# EasyEDA schematic SCH_Record-wav_2025-12-09 (1).json
TITLE: 1.2; REV: 1.0; Date: 2025-11-29; Sheet: 1/1; Drawn By: Shaik Sohail Ahmed; Company: novum
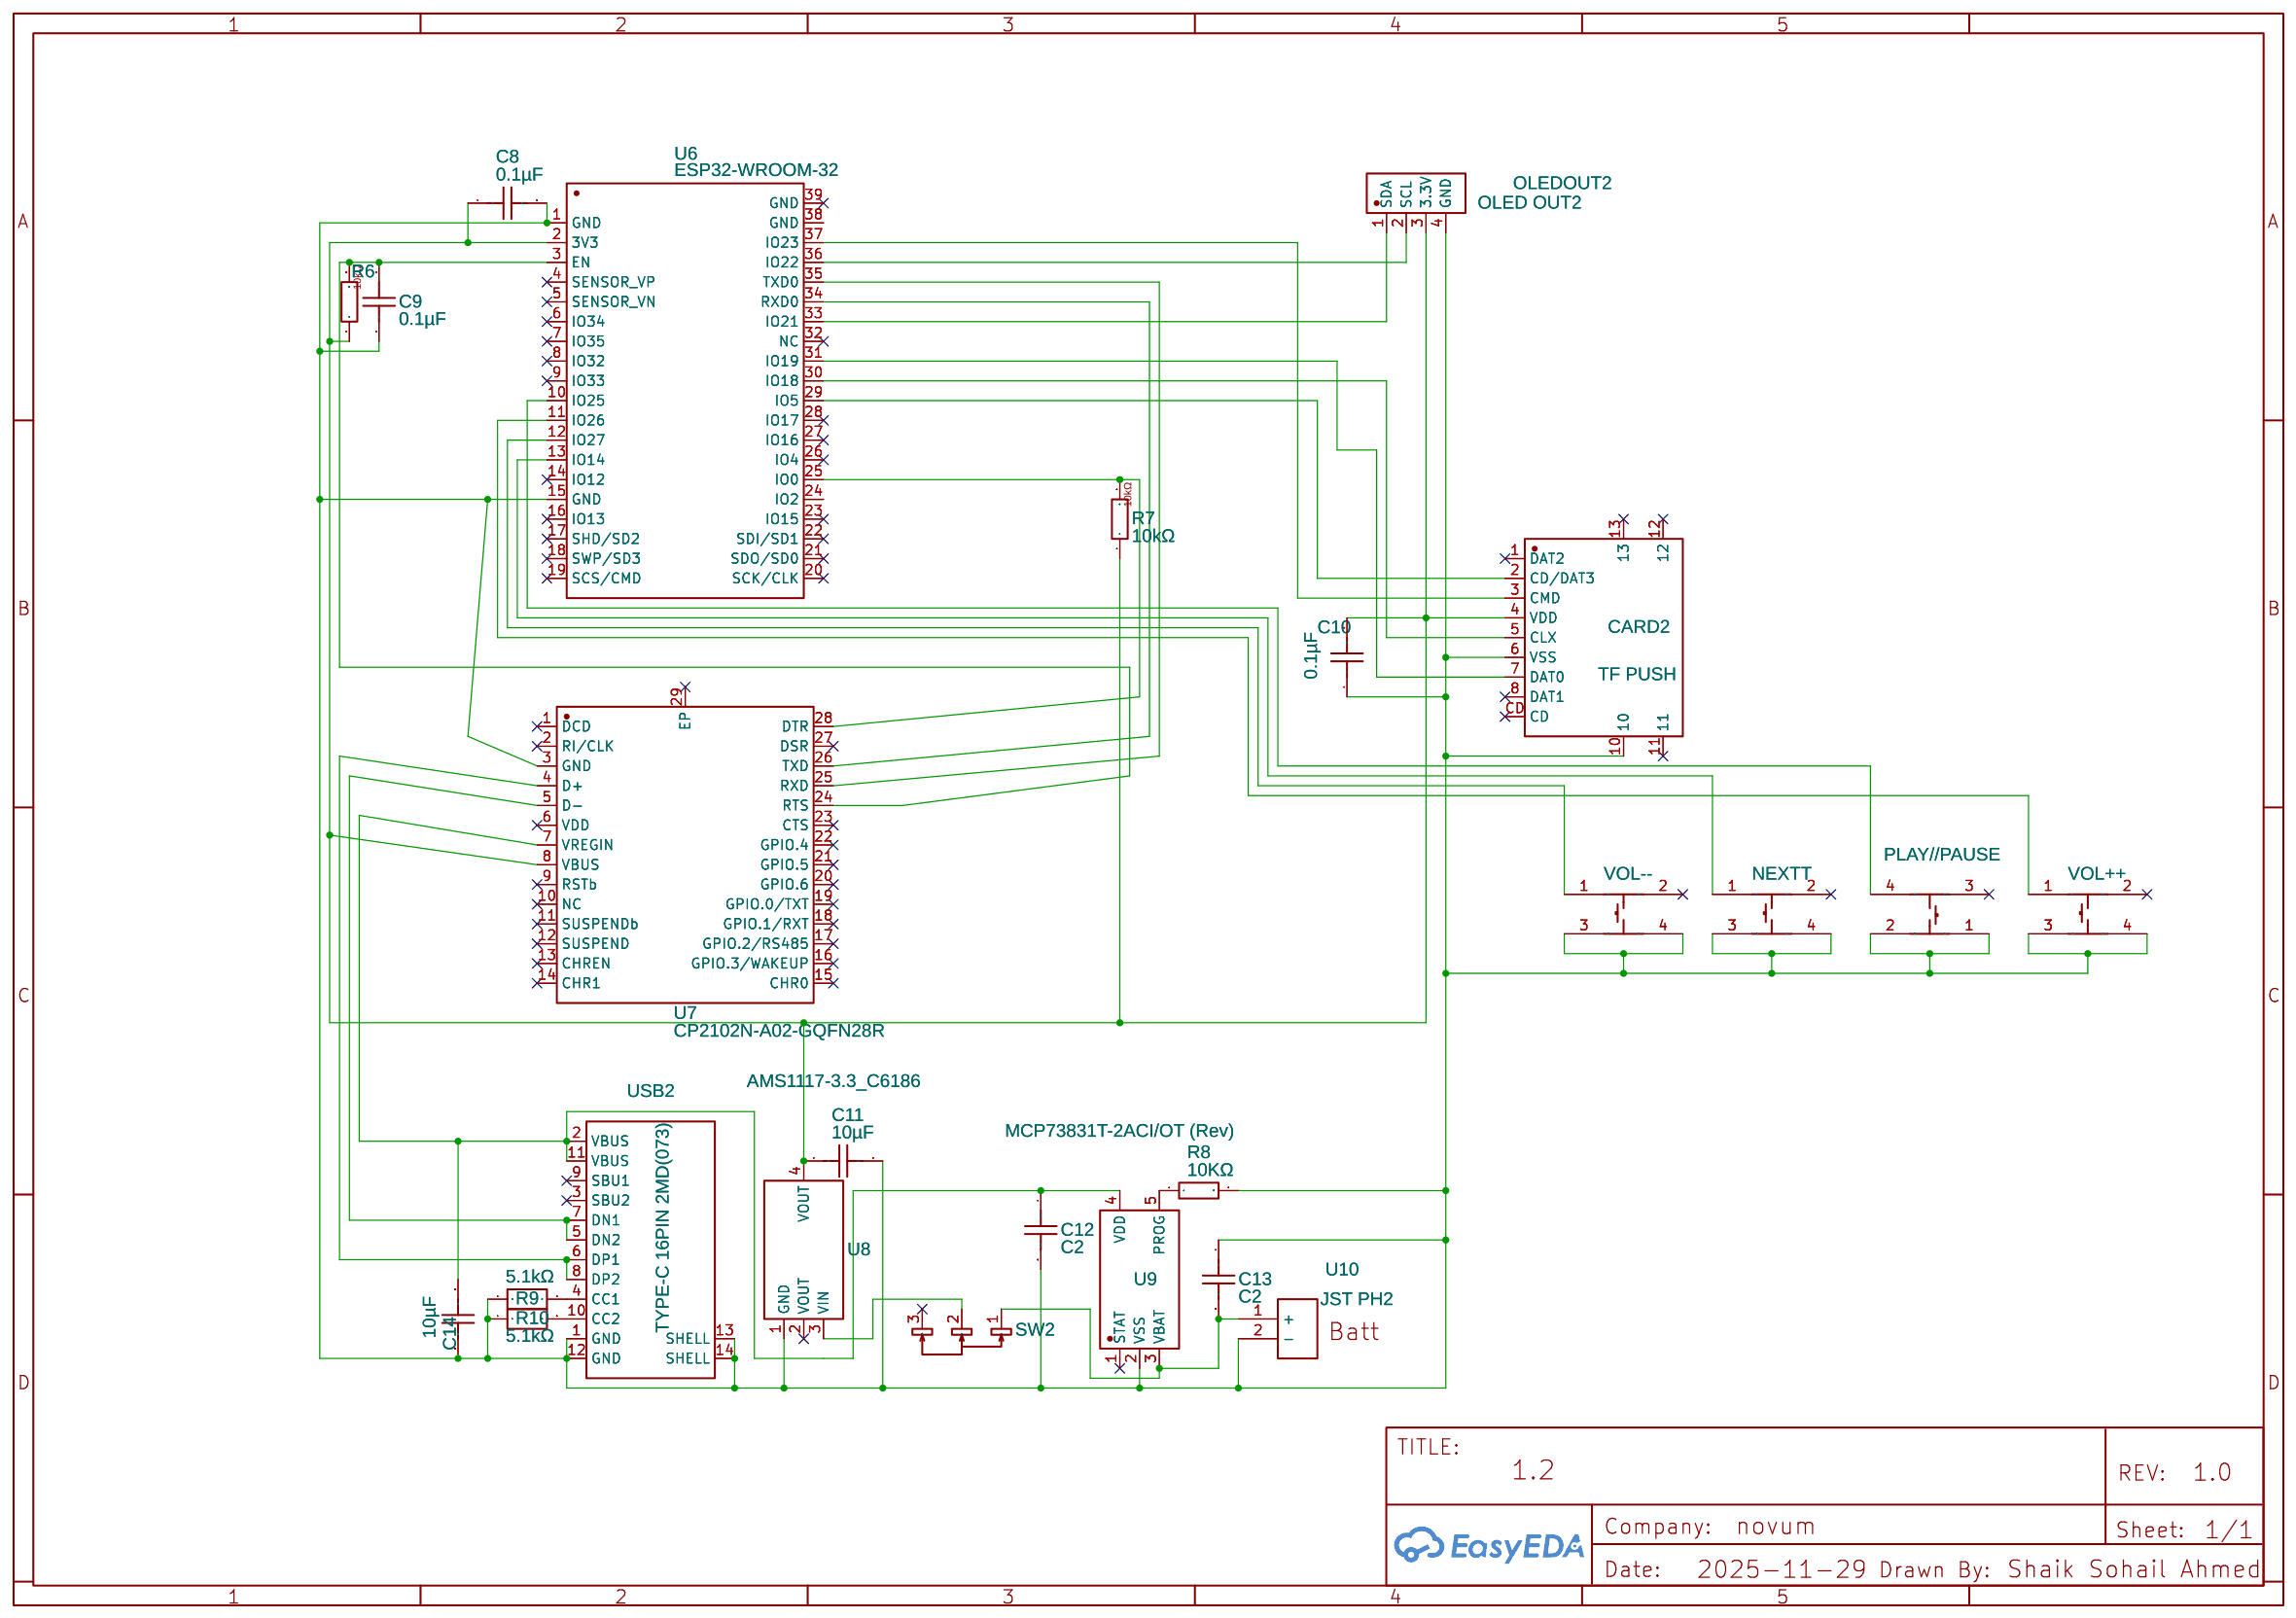
[diagram p0: schematic sheet]

## Parts
C8  0.1µF  [0402]
C9  0.1µF  [0402]
C10  0.1µF  [0402]
C11  10µF  [C0603]
C12  C2  [D0805]
C13  C2  [D0805]
C14  10µF  [C0603]
CARD2  TF PUSH  [TF-SMD_TF-PUSH]
NEXTT  TS-1002S-07026C  [KEY-SMD_4P-L6.0-W6.0-P4.50-LS9.0]
OLEDOUT2  OLED OUT2  [PADPAD4X1.5 4PAD_SIGNALS]
PLAY//PAUSE  TS-1002S-07026C  [KEY-SMD_4P-L6.0-W6.0-P4.50-LS9.0]
R6  10kΩ  [10KΩ]
R7  10kΩ  [10KΩ]
R8  10KΩ  [AXIAL-0.4]
R9  5.1kΩ  [R1206]
R10  5.1kΩ  [R1206]
SW2  MST-12D18G4 SPDT SLIDE SWITCH  [SW-SMD_MST-12D18G4-SPDT-SLIDE-SWITCH]
U6  ESP32-WROOM-32  [WIFIM-SMD_ESP32-WROOM-32-N4]
U7  CP2102N-A02-GQFN28R  [QFN-28_L5.0-W5.0-P0.50-TL-EP3.3]
U8  AMS1117-3.3_C6186  [AMS1117]
U9  MCP73831T-2ACI/OT (Rev)  [SOT-23-5_L3.0-W1.7-P0.95-LS2.8-BL]
U10  JST PH2  [JST-PH-JST-PH2]
USB2  TYPE-C 16PIN 2MD(073)  [USB-C-SMD_TYPE-C-6PIN-2MD-073]
VOL++  TS-1002S-07026C  [KEY-SMD_4P-L6.0-W6.0-P4.50-LS9.0]
VOL--  TS-1002S-07026C  [KEY-SMD_4P-L6.0-W6.0-P4.50-LS9.0]

## Library data of the parts
C8-C10 = 0.1µF: Supplier Part: C86039; Supplier: LCSC; Manufacturer: muRata; Manufacturer Part: GRM152R60J104ME19D
C11 C14 = CL10A106MA8NRNC: Manufacturer: Samsung Electro-Mechanics; Supplier Part: 1276-1869-1-ND; Supplier: Digi-Key; link: https://www.digikey.ca/en/products/detail/samsung-electro-mechanics/CL10A106MA8NRNC/3887527; Contributor: deserresalex; Voltage: 25V; Tolerance: 20%
C12 C13 = 08053C105JAT2A: Manufacturer: KYOCERA AVX; Supplier: Digi-Key; Supplier Part: 478-10487-1-ND; link: https://www.digikey.ca/en/products/detail/kyocera-avx/08053C105JAT2A/1602174; Contributor: efpepeople
CARD2 = TF PUSH: Contributor: LCSC; Supplier: LCSC; Supplier Part: C393941; Manufacturer: SHOU HAN(首韩); JLCPCB Part Class: Extended Part
NEXTT PLAY//PAUSE VOL++ VOL-- = TS-1002S-07026C: Contributor: LCSC; Supplier: LCSC; Supplier Part: C455114; Manufacturer: XUNPU(讯普); JLCPCB Part Class: Extended Part
OLEDOUT2 = Solder_Pad_4: Contributor: dwaterkott
R6 R7 = 10kΩ: Contributor: Aries Castillo
R8 = 10KΩ: Power: 1/4W; Tolerance: ±5%; Supplier Part: C61299; Supplier: LCSC; Manufacturer Part: CFR0W4J0103A50; Manufacturer: UniOhm
R9 R10 = 5.1KΩ 1/4W ±1% SMD: Supplier: LCSC; Supplier Part: C2933721; Manufacturer: FOJAN(富捷); Manufacturer Part: FRC1206F5101TS; JLCPCB Part Class: Extended Part; Contributor: lcsc
SW2 = MST-12D18G4 SPDT SLIDE SWITCH: Supplier: LCSC; Supplier Part: C49023767; Manufacturer: SHOU HAN(首韩); Manufacturer Part: MST-12D18G4 SPDT Slide Switch; JLCPCB Part Class: Extended Part; Contributor: lcsc
U6 = ESP32-WROOM-32: Contributor: LCSC; Supplier: LCSC; Supplier Part: C82899; Manufacturer: ESPRESSIF(乐鑫); Manufacturer Part: ESP32-WROOM-32-N4; JLCPCB Part Class: Extended Part
U7 = CP2102N-A02-GQFN28R: Contributor: LCSC; Supplier: LCSC; Supplier Part: C964632; Manufacturer: SKYWORKS/SILICON LABS(芯科); JLCPCB Part Class: Extended Part
U8 = AMS1117-3.3_C6186: Output Type: Output Polarity:Positive Number of Outputs:1 Maximum Input Voltage:- Output Voltage:3.3V~3.3V Output Voltage:3.3V~3.3V Dropout Voltage:1.3V@(800mA) Quiescent Current (Ground Current):- Output Current:1A Power Supply Rejection Ratio (PSRR):72d; Name: AMS1117-3.3; Symbol: AMS1117-3.3; LCSC Part Name: 输出3.3V 1A; Supplier Part: C6186; Manufacturer: AMS; Manufacturer Part: AMS1117-3.3; Supplier Footprint: SOT-223; JLCPCB Part Class: Basic Part; Datasheet: https://atta.szlcsc.com/upload/public/pdf/source/20180727/C6186_7A095716F0823C02F1997A905E26C086.pdf; Supplier: LCSC; Add into BOM: yes; Convert to PCB: yes; Output Polarity: Positive; Number of Outputs: 1; Output Voltage: 3.3V~3.3V; Dropout Voltage: 1.3V@(800mA); Output Current: 1A; Power Supply Rejection Ratio (PSRR): 72dB@(120Hz); Contributor: simplenikt
U9 = MCP73831T-2ACI/OT (Rev): Contributor: mikeraffone; Supplier: LCSC; Supplier Part: C424093; Manufacturer: MICROCHIP(美国微芯); Manufacturer Part: MCP73831T-2ACI/OT; JLCPCB Part Class: Extended Part
U10 = JST PH2: Contributor: pwarrow99
USB2 = TYPE-C 16PIN 2MD(073): Supplier: LCSC; Supplier Part: C2765186; Manufacturer: SHOU HAN(首韩); Contributor: jplobst; JLCPCB Part Class: Extended Part

## Nets
Net-(C8-1): C8.1 C10.2 C11.1 CARD2.4(VDD) OLEDOUT2.3(3.3V) R6.1 R7.1 U6.2(3V3) U7.8(VBUS) U8.4(VOUT)
Net-(C8-2): C8.2 C9.1 C10.1 C11.2 C12.2 C13.1 C14.2 CARD2.6(VSS) CARD2.10 NEXTT.3 NEXTT.4 OLEDOUT2.4(GND) PLAY//PAUSE.1 PLAY//PAUSE.2 R8.2 R9.1 R10.1 U6.1(GND) U6.15(GND) U7.3(GND) U8.1(GND) U9.2(VSS) U10.2(-) USB2.1(GND) USB2.12(GND) USB2.13(SHELL) USB2.14(SHELL) VOL++.3 VOL++.4 VOL--.3 VOL--.4
Net-(C9-2): C9.2 R6.2 U6.3(EN) U7.24(RTS)
Net-(C12-1): C12.1 C14.1 U7.7(VREGIN) U9.4(VDD) USB2.2(VBUS) USB2.11(VBUS)
Net-(C13-2): C13.2 SW2.1 U9.3(VBAT) U10.1(+)
Net-(CARD2-2): CARD2.2(CD/DAT3) U6.29(IO5)
Net-(CARD2-3): CARD2.3(CMD) U6.37(IO23)
Net-(CARD2-5): CARD2.5(CLX) U6.30(IO18)
Net-(CARD2-7): CARD2.7(DAT0) U6.31(IO19)
Net-(NEXTT-1): NEXTT.1 U6.13(IO14)
Net-(OLEDOUT2-1): OLEDOUT2.1(SDA) U6.33(IO21)
Net-(OLEDOUT2-2): OLEDOUT2.2(SCL) U6.36(IO22)
Net-(PLAY//PAUSE-4): PLAY//PAUSE.4 U6.10(IO25)
Net-(R7-2): R7.2 U6.25(IO0) U7.28(DTR)
Net-(R8-1): R8.1 U9.5(PROG)
Net-(R9-2): R9.2 USB2.4(CC1)
Net-(R10-2): R10.2 USB2.10(CC2)
Net-(SW2-2): SW2.2 U8.3(VIN)
Net-(U6-11): U6.11(IO26) VOL++.1
Net-(U6-12): U6.12(IO27) VOL--.1
Net-(U6-34): U6.34(RXD0) U7.26(TXD)
Net-(U6-35): U6.35(TXD0) U7.25(RXD)
Net-(U7-4): U7.4(D+) USB2.6(DP1) USB2.8(DP2)
Net-(U7-5): U7.5(D-) USB2.5(DN2) USB2.7(DN1)

Not connected (* = marked no-connect by the designer): CARD2 1(DAT2)* 8(DAT1)* 11* 12* 13* CD*; NEXTT 2*; PLAY//PAUSE 3*; SW2 3*; U6 4(SENSOR_VP)* 5(SENSOR_VN)* 6(IO34)* 7(IO35)* 8(IO32)* 9(IO33)* 14(IO12)* 16(IO13)* 17(SHD/SD2)* 18(SWP/SD3)* 19(SCS/CMD)* 20(SCK/CLK)* 21(SDO/SD0)* 22(SDI/SD1)* 23(IO15)* 24(IO2) 26(IO4)* 27(IO16)* 28(IO17)* 32(NC)* 38(GND) 39(GND)*; U7 1(DCD)* 2(RI/CLK)* 6(VDD)* 9(RSTb)* 10(NC)* 11(SUSPENDb)* 12(SUSPEND)* 13(CHREN)* 14(CHR1)* 15(CHR0)* 16(GPIO.3/WAKEUP)* 17(GPIO.2/RS485)* 18(GPIO.1/RXT)* 19(GPIO.0/TXT)* 20(GPIO.6)* 21(GPIO.5)* 22(GPIO.4)* 23(CTS)* 27(DSR)* 29(EP)*; U8 2(VOUT)*; U9 1(STAT)*; USB2 3(SBU2)* 9(SBU1)*; VOL++ 2*; VOL-- 2*
